# EAGLE design pattern_game (EAGLE 9.6.2)
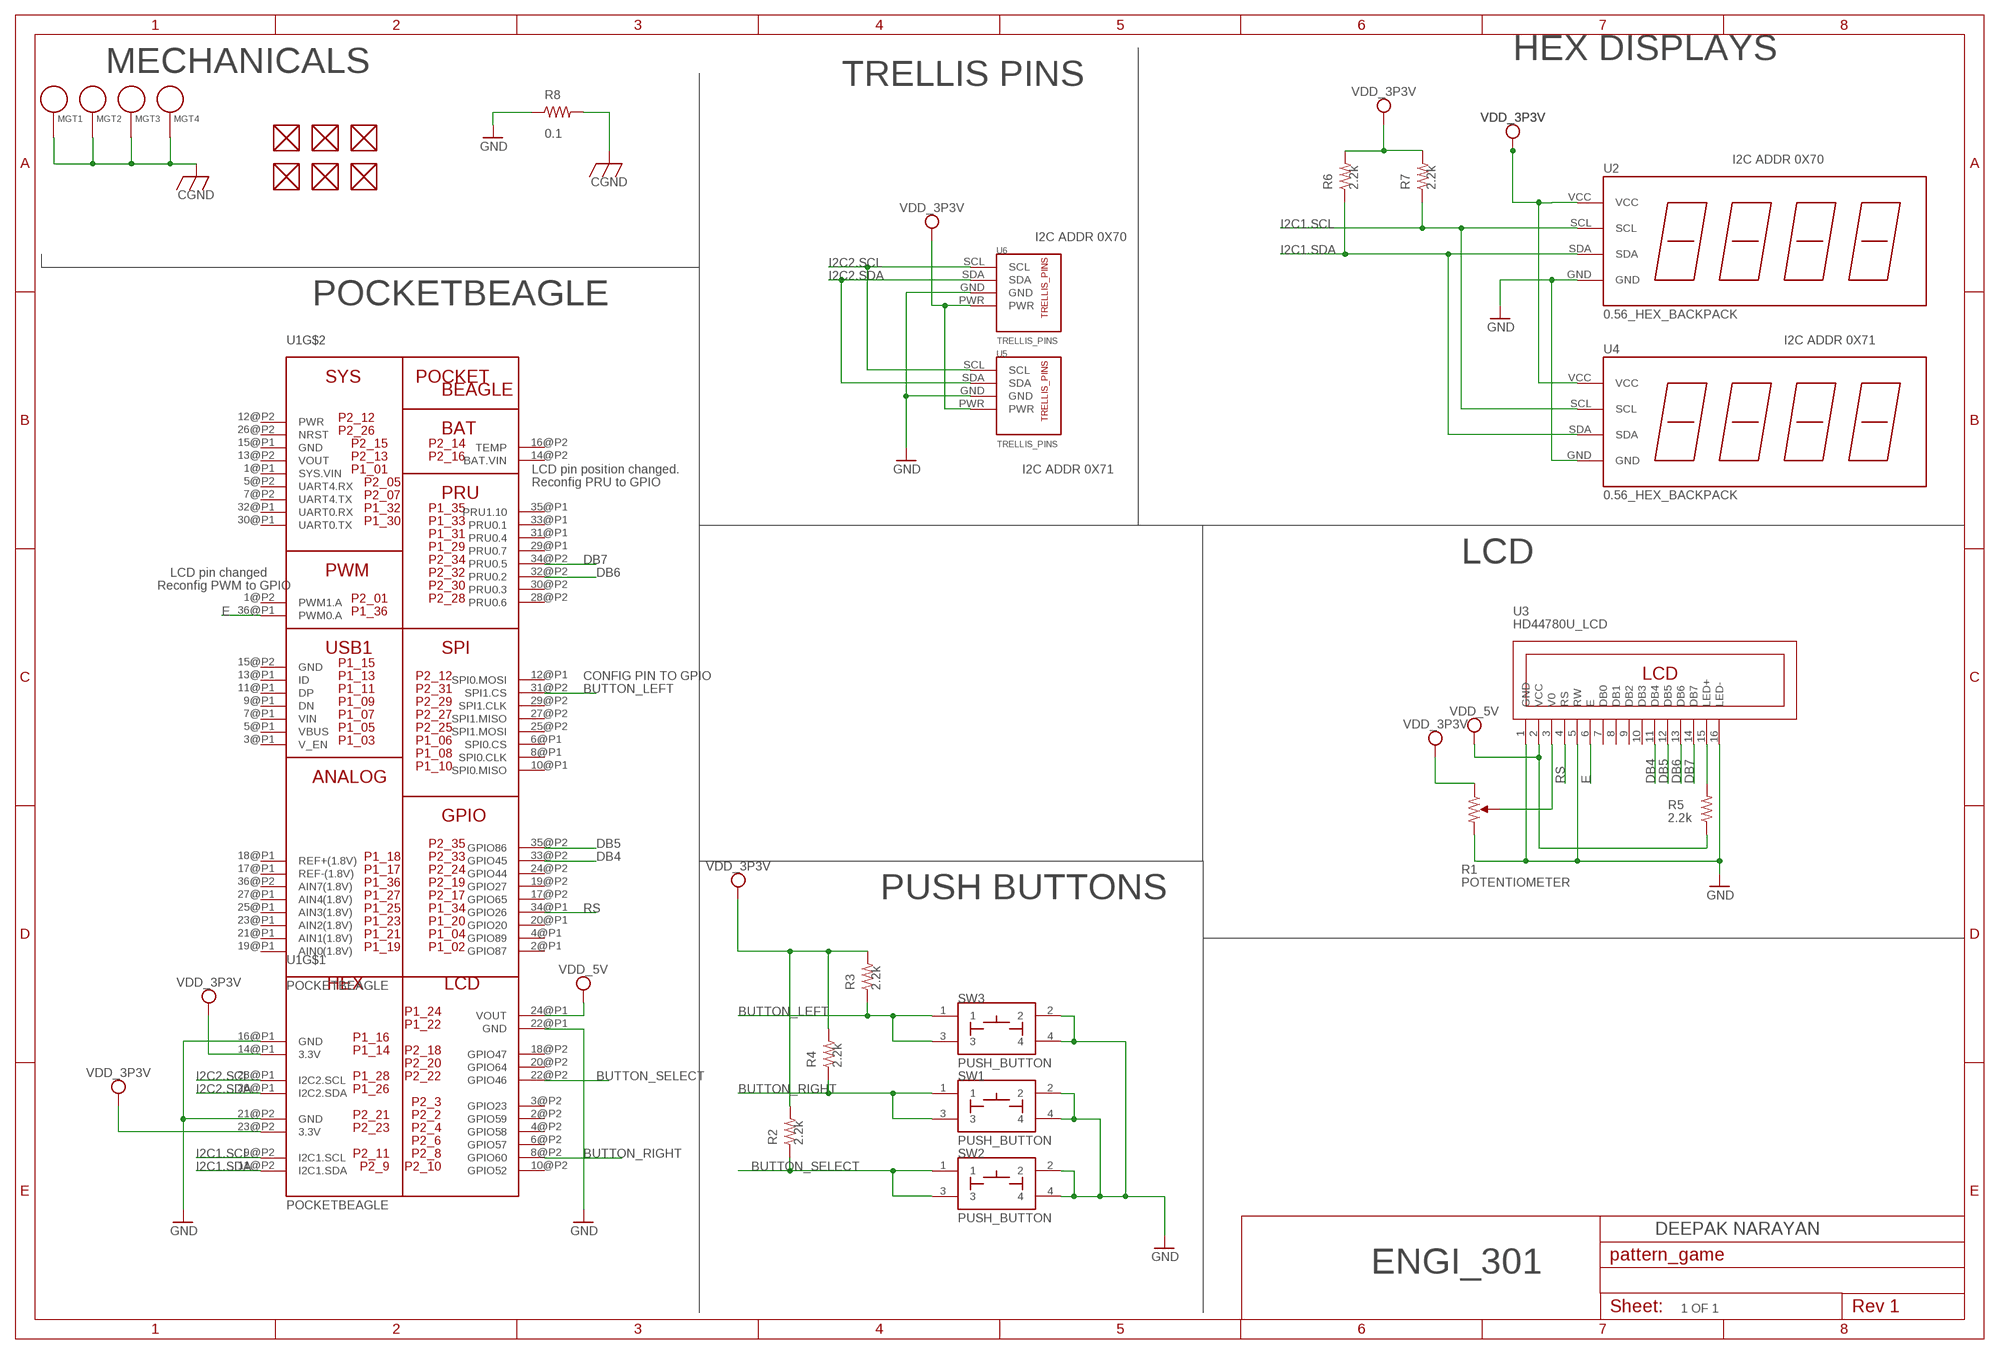
[diagram p0: schematic, sheet 1]

## Parts
FUD1  FIDUCIAL  [FIDUCIAL_40MIL]
FUD2  FIDUCIAL  [FIDUCIAL_40MIL]
FUD3  FIDUCIAL  [FIDUCIAL_40MIL]
FUD4  FIDUCIAL  [FIDUCIAL_40MIL]
FUD5  FIDUCIAL  [FIDUCIAL_40MIL]
FUD6  FIDUCIAL  [FIDUCIAL_40MIL]
MGT1  MOUNTING_HOLE  [MOUNTING_HOLE]
MGT2  MOUNTING_HOLE  [MOUNTING_HOLE]
MGT3  MOUNTING_HOLE  [MOUNTING_HOLE]
MGT4  MOUNTING_HOLE  [MOUNTING_HOLE]
R1  POTENTIOMETER  [POT-PO90S]
R2  2.2k  R_R0603  [R0603]
R3  2.2k  R_R0603  [R0603]
R4  2.2k  R_R0603  [R0603]
R5  2.2k  R_R0603  [R0603]
R6  2.2k  R_R0603  [R0603]
R7  2.2k  R_R0603  [R0603]
R8  0.1  R_R0603  [R0603]
SW1  PUSH_BUTTON  [BUTTON_12.5MM]
SW2  PUSH_BUTTON  [BUTTON_12.5MM]
SW3  PUSH_BUTTON  [BUTTON_12.5MM]
U1  POCKETBEAGLE  [POCKETBEAGLE]
U2  0.56_HEX_BACKPACK  [0.56_HEX_BACKPACK]
U3  HD44780U_LCD  [HD44780U_LCD]
U4  0.56_HEX_BACKPACK  [0.56_HEX_BACKPACK]
U5  TRELLIS_PINS  [TRELLIS_PINS]
U6  TRELLIS_PINS  [TRELLIS_PINS]

## Nets
BUTTON_LEFT: R3.1 SW3.1 SW3.3 U1.31@P2(SPI1.CS)
BUTTON_RIGHT: R4.1 SW1.1 SW1.3 U1.8@P2(GPIO60)
BUTTON_SELECT: R2.1 SW2.1 SW2.3 U1.22@P2(GPIO46)
CGND: MGT1.P$1 MGT2.P$1 MGT3.P$1 MGT4.P$1 R8.2
DB4: U1.33@P2(GPIO45) U3.11(DB4)
DB5: U1.35@P2(GPIO86) U3.12(DB5)
DB6: U1.32@P2(PRU0.2) U3.13(DB6)
DB7: U1.34@P2(PRU0.5) U3.14(DB7)
E: U1.36@P1(PWM0.A) U3.6(E)
GND: R1.CW R8.1 SW1.2 SW1.4 SW2.2 SW2.4 SW3.2 SW3.4 U1.16@P1(GND) U1.21@P2(GND) U1.22@P1(GND) U2.GND U3.1(GND) U3.5(RW) U3.16(LED-) U4.GND U5.GND U6.GND
I2C1.SCL: R7.1 U1.9@P2(I2C1.SCL) U2.SCL U4.SCL
I2C1.SDA: R6.1 U1.11@P2(I2C1.SDA) U2.SDA U4.SDA
I2C2.SCL: U1.28@P1(I2C2.SCL) U5.SCL U6.SCL
I2C2.SDA: U1.26@P1(I2C2.SDA) U5.SDA U6.SDA
N$1: R1.S U3.3(V0)
N$2: R5.2 U3.15(LED+)
RS: U1.34@P1(GPIO26) U3.4(RS)
VDD_3P3V: R1.CCW R2.2 R3.2 R4.2 R6.2 R7.2 U1.14@P1(3.3V) U1.23@P2(3.3V) U2.VCC U4.VCC U5.PWR U6.PWR
VDD_5V: R5.1 U1.24@P1(VOUT) U3.2(VCC)
Unconnected: FUD1.P$1 FUD2.P$1 FUD3.P$1 FUD4.P$1 FUD5.P$1 FUD6.P$1 U1.1@P1(SYS.VIN) U1.1@P2(PWM1.A) U1.2@P1(GPIO87) U1.2@P2(GPIO59) U1.3@P1(V_EN) U1.3@P2(GPIO23) U1.4@P1(GPIO89) U1.4@P2(GPIO58) U1.5@P1(VBUS) U1.5@P2(UART4.RX) U1.6@P1(SPI0.CS) U1.6@P2(GPIO57) U1.7@P1(VIN) U1.7@P2(UART4.TX) U1.8@P1(SPI0.CLK) U1.9@P1(DN) U1.10@P1(SPI0.MISO) U1.10@P2(GPIO52) U1.11@P1(DP) U1.12@P1(SPI0.MOSI) U1.12@P2(PWR) U1.13@P1(ID) U1.13@P2(VOUT) U1.14@P2(BAT.VIN) U1.15@P1(GND) U1.15@P2(GND) U1.16@P2(TEMP) U1.17@P1(REF-(1.8V)) U1.17@P2(GPIO65) U1.18@P1(REF+(1.8V)) U1.18@P2(GPIO47) U1.19@P1(AIN0(1.8V)) U1.19@P2(GPIO27) U1.20@P1(GPIO20) U1.20@P2(GPIO64) U1.21@P1(AIN1(1.8V)) U1.23@P1(AIN2(1.8V)) U1.24@P2(GPIO44) U1.25@P1(AIN3(1.8V)) U1.25@P2(SPI1.MOSI) U1.26@P2(NRST) U1.27@P1(AIN4(1.8V)) U1.27@P2(SPI1.MISO) U1.28@P2(PRU0.6) U1.29@P1(PRU0.7) U1.29@P2(SPI1.CLK) U1.30@P1(UART0.TX) U1.30@P2(PRU0.3) U1.31@P1(PRU0.4) U1.32@P1(UART0.RX) U1.33@P1(PRU0.1) U1.35@P1(PRU1.10) U1.36@P2(AIN7(1.8V)) U3.7(DB0) U3.8(DB1) U3.9(DB2) U3.10(DB3)

## Notes on the sheet
- HEX DISPLAYS
- MECHANICALS
- TRELLIS PINS
- I2C ADDR 0X70
- I2C ADDR 0X70
- POCKETBEAGLE
- I2C ADDR 0X71
- LCD pin position changed. | I2C ADDR 0X71
- Reconfig PRU to GPIO
- LCD
- LCD pin changed
- Reconfig PWM to GPIO
- CONFIG PIN TO GPIO
- PUSH BUTTONS
- DEEPAK NARAYAN
- ENGI_301
- 1 OF 1

## Library data of the parts
FUD1-FUD6 = combo_lock:FIDUCIAL
MGT1-MGT4 = combo_lock:MOUNTING_HOLE: Chassis Mounting Hole w/GND connection ability
R1 = PATTERN_GAME:POTENTIOMETER: Potentiometer - Examples: P090S-14T20BR10K (987-1277-ND)
R2-R7 = PATTERN_GAME:R_: RESISTOR, American symbol
R8 = combo_lock:R_: RESISTOR, American symbol
SW1-SW3 = PATTERN_GAME:PUSH_BUTTON
U1 = PATTERN_GAME:POCKETBEAGLE
U2 U4 = PATTERN_GAME:0.56_HEX_BACKPACK
U3 = PATTERN_GAME:HD44780U_LCD
U5 U6 = PATTERN_GAME:TRELLIS_PINS

## Board
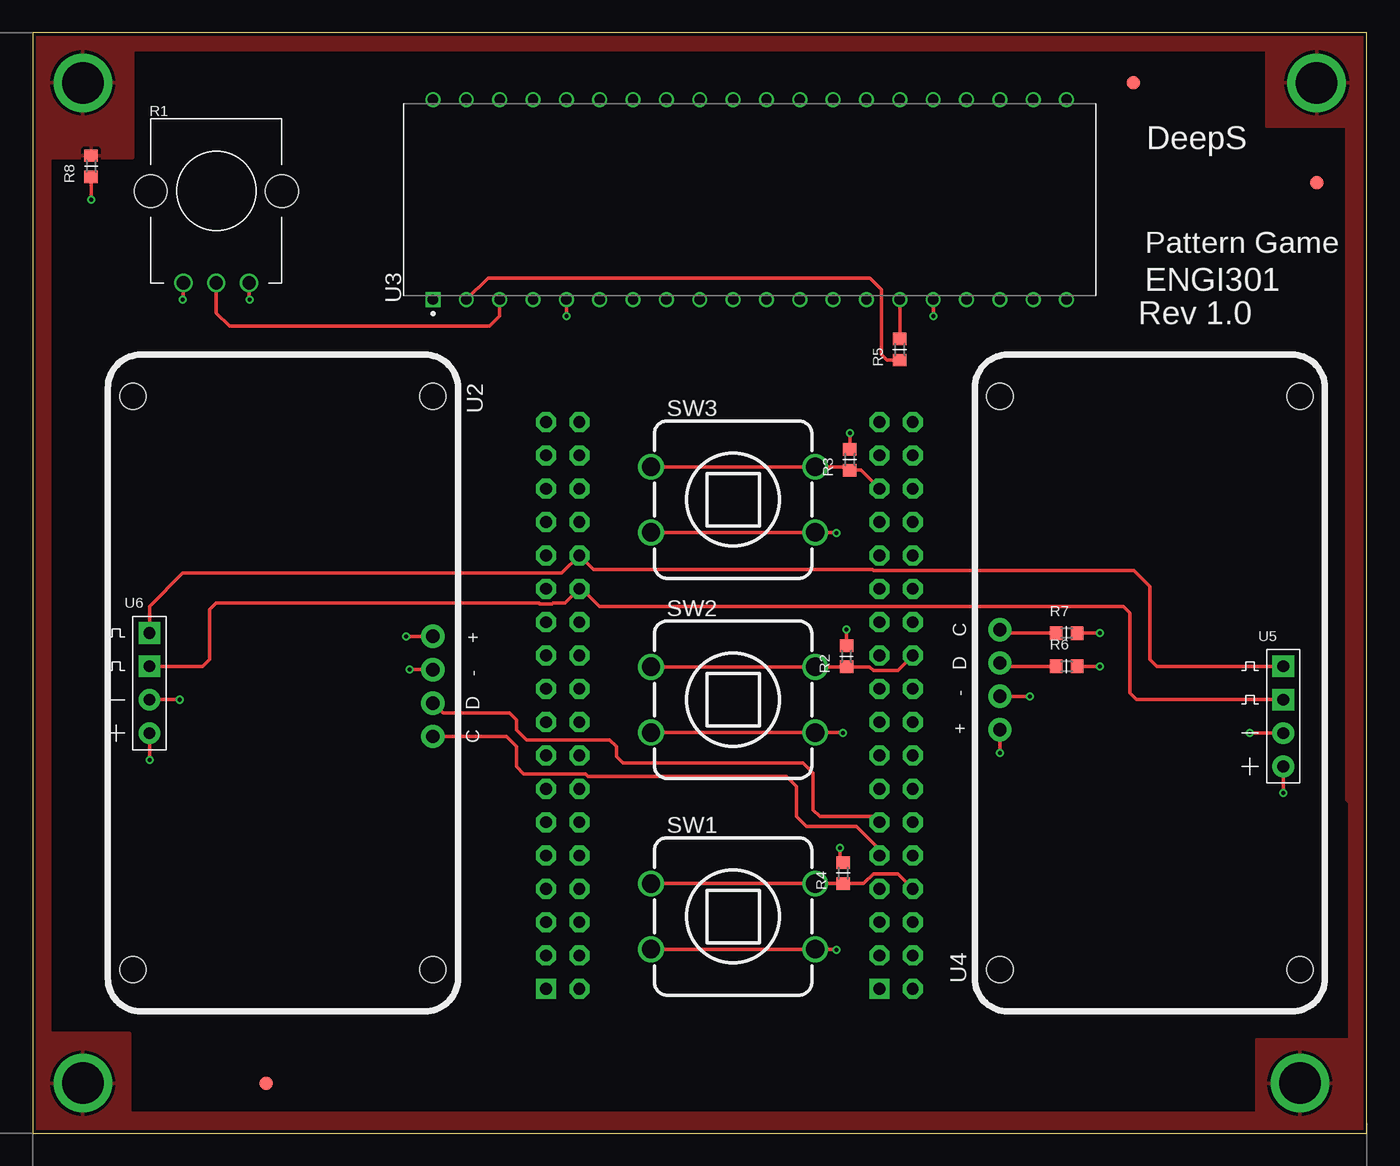
[diagram p1: board, top side]
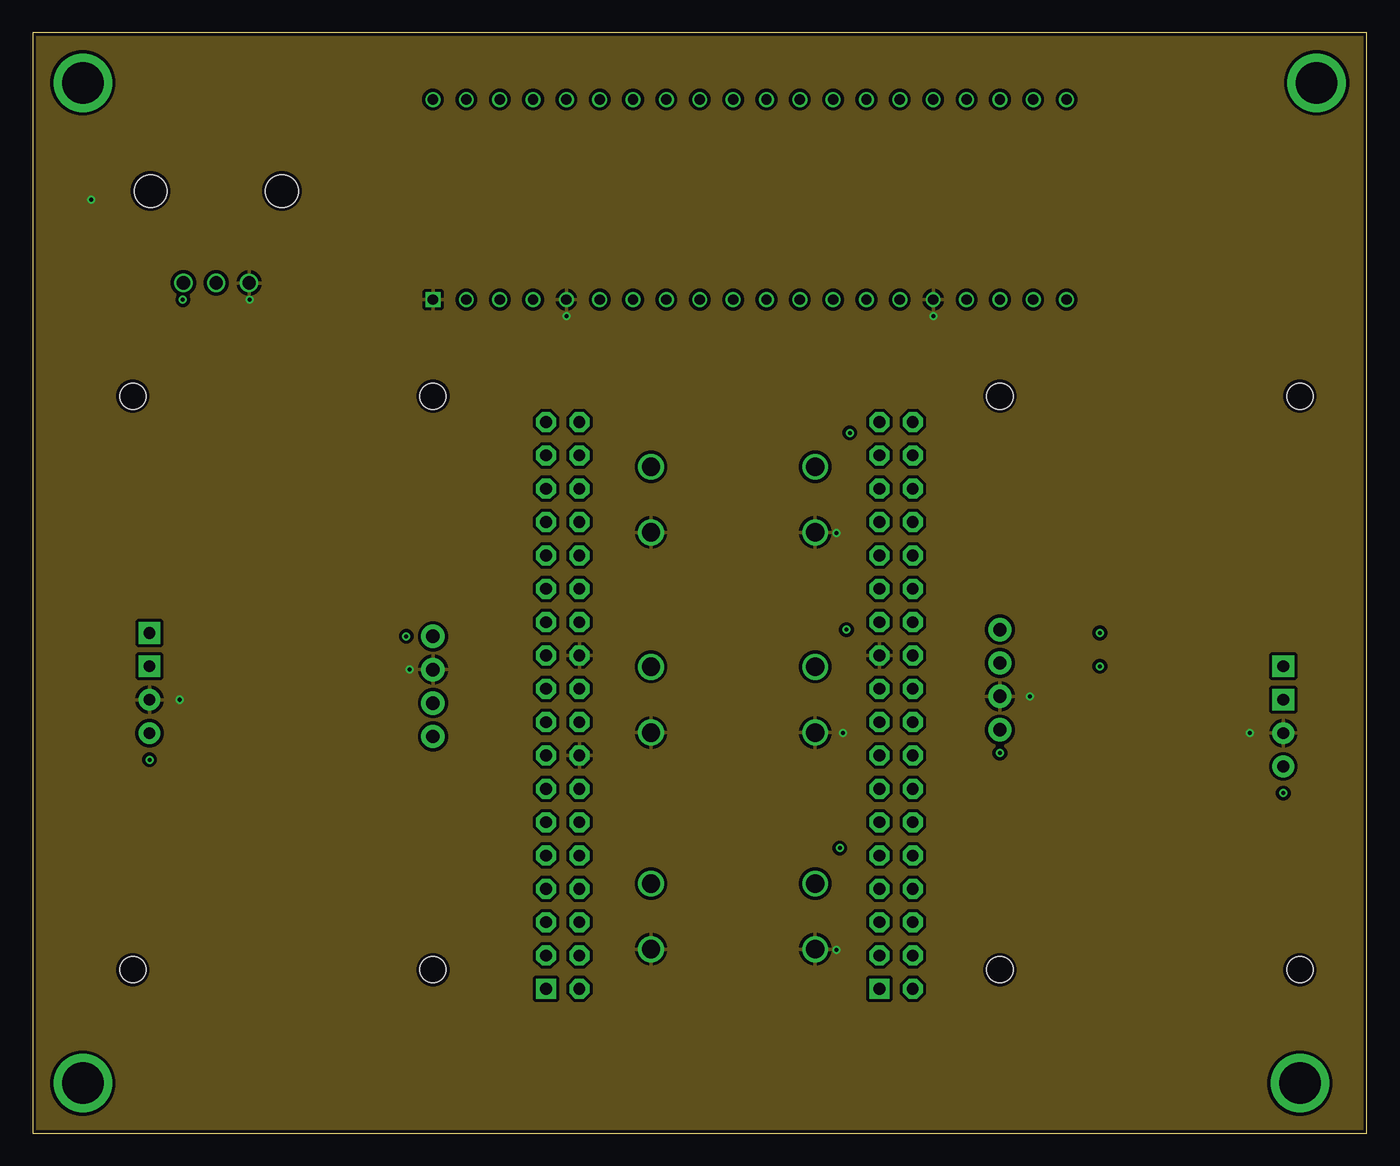
[diagram p2: board, inner layer Route2]
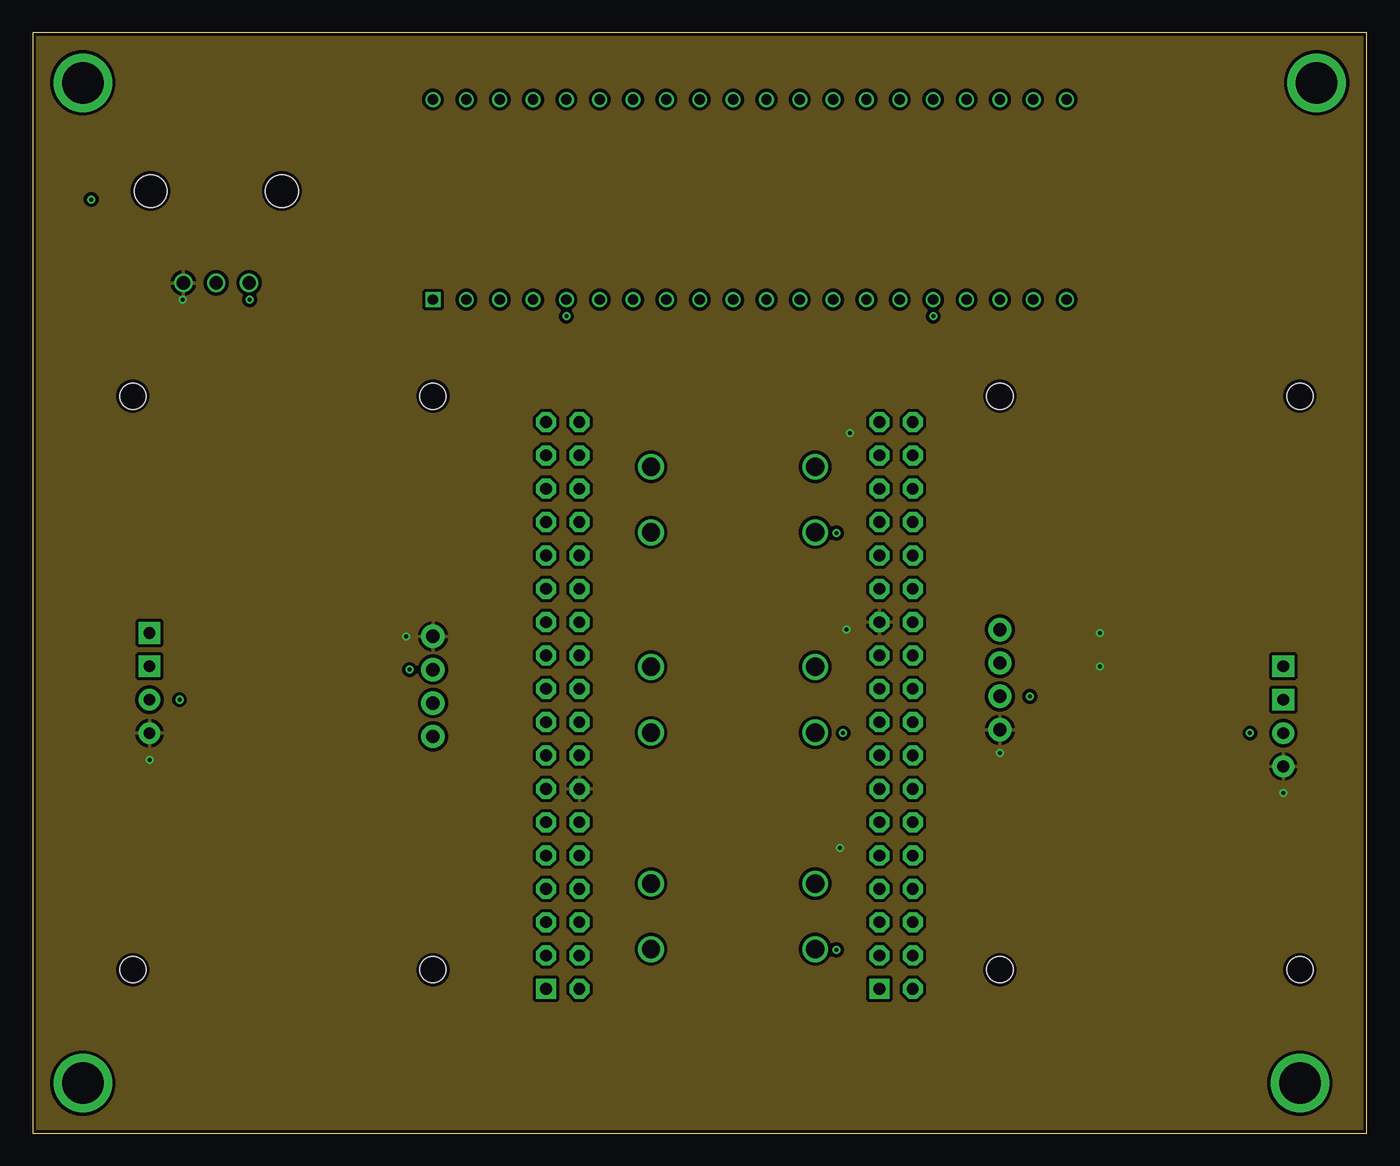
[diagram p3: board, inner layer Route15]
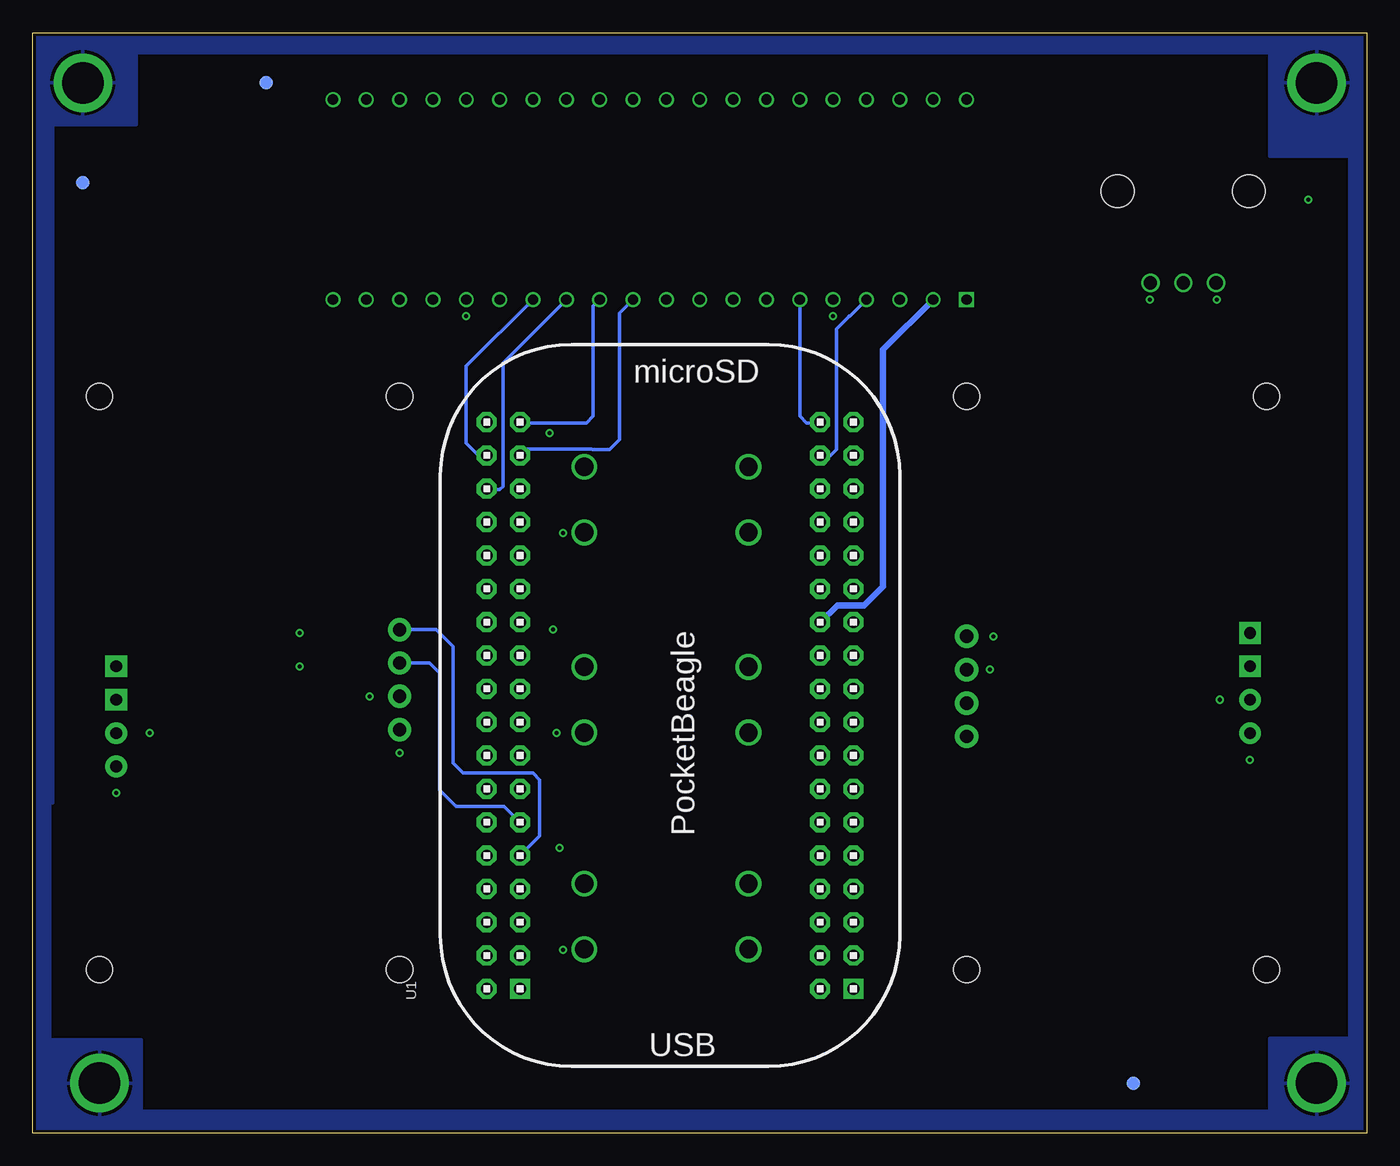
[diagram p4: board, bottom side, seen from below]

Size 101.6 x 83.82 mm. Coordinates in mm from the lower left corner, seen from the top.
Outline: 0,0 101.6,0 101.6,83.82 0,83.82 0,0
Copper layers (1*2*15*16): Top 0.035mm / dielectric 0.23mm / Route2 0.035mm / dielectric 0.93mm / Route15 0.035mm / dielectric 0.23mm / Bottom 0.035mm
Design rules "ENGI301_4lyr": minimum track width 10mil, minimum drill 12mil, track to track 10mil, track to pad 10mil, pad to pad 10mil, via to via 10mil, smd to smd 10mil, copper to edge 10mil, drill to drill 12mil, minimum pad ring 6mil, minimum via ring 6mil, stop-mask expansion 3mil, vias tented up to drill 25mil, thermal gap 10mil

### Footprints (pad centres in the part's own frame; a part is rotated, then mirrored left to right if it is on the bottom)
FIDUCIAL_40MIL = smd 1.016 x 1.016: P$1 0,0
MOUNTING_HOLE = drill 3.175 pad 4.445: P$1 0,0
POT-PO90S = drill 1: CCW -2.5,0; CW 2.5,0; S 0,0 | hole 2.5: -5,7; 5,7
R0603 = smd 0.95 x 1.031: 1 -0.8,0; 2 0.8,0
BUTTON_12.5MM = drill 1.4: 1 -6.25,2.5; 2 -6.25,-2.5; 3 6.25,2.5; 4 6.25,-2.5
POCKETBEAGLE = drill 0.889 pad 1.524 square: 1@P1 5.91,3.53; 1@P2 5.91,28.93 | drill 0.889 pad 1.524 octagon: 2@P1 5.91,6.07; 2@P2 5.91,31.47; 3@P1 8.45,3.53; 3@P2 8.45,28.93; 4@P1 8.45,6.07; 4@P2 8.45,31.47; 5@P1 10.99,3.53; 5@P2 10.99,28.93; 6@P1 10.99,6.07; 6@P2 10.99,31.47; 7@P1 13.53,3.53; 7@P2 13.53,28.93; 8@P1 13.53,6.07; 8@P2 13.53,31.47; 9@P1 16.07,3.53; 9@P2 16.07,28.93; 10@P1 16.07,6.07; 10@P2 16.07,31.47; 11@P1 18.61,3.53; 11@P2 18.61,28.93; 12@P1 18.61,6.07; 12@P2 18.61,31.47; 13@P1 21.15,3.53; 13@P2 21.15,28.93; 14@P1 21.15,6.07; 14@P2 21.15,31.47; 15@P1 23.69,3.53; 15@P2 23.69,28.93; 16@P1 23.69,6.07; 16@P2 23.69,31.47; 17@P1 26.23,3.53; 17@P2 26.23,28.93; 18@P1 26.23,6.07; 18@P2 26.23,31.47; 19@P1 28.77,3.53; 19@P2 28.77,28.93; 20@P1 28.77,6.07; 20@P2 28.77,31.47; 21@P1 31.31,3.53; 21@P2 31.31,28.93; 22@P1 31.31,6.07; 22@P2 31.31,31.47; 23@P1 33.85,3.53; 23@P2 33.85,28.93; 24@P1 33.85,6.07; 24@P2 33.85,31.47; 25@P1 36.39,3.53; 25@P2 36.39,28.93; 26@P1 36.39,6.07; 26@P2 36.39,31.47; 27@P1 38.93,3.53; 27@P2 38.93,28.93; 28@P1 38.93,6.07; 28@P2 38.93,31.47; 29@P1 41.47,3.53; 29@P2 41.47,28.93; 30@P1 41.47,6.07; 30@P2 41.47,31.47; 31@P1 44.01,3.53; 31@P2 44.01,28.93; 32@P1 44.01,6.07; 32@P2 44.01,31.47; 33@P1 46.55,3.53; 33@P2 46.55,28.93; 34@P1 46.55,6.07; 34@P2 46.55,31.47; 35@P1 49.09,3.53; 35@P2 49.09,28.93; 36@P1 49.09,6.07; 36@P2 49.09,31.47
0.56_HEX_BACKPACK = drill 1.016 pad 1.778: GND -1.016,11.43; SCL 4.064,11.43; SDA 1.524,11.43; VCC -3.556,11.43 | hole 2: -21.844,-11.43; 21.844,-11.43; -21.844,11.43; 21.844,11.43
HD44780U_LCD = drill 0.79 pad 1.14 square: 1 -7.62,24.13 | drill 0.79 pad 1.14: 2 -7.62,21.59; 3 -7.62,19.05; 4 -7.62,16.51; 5 -7.62,13.97; 6 -7.62,11.43; 7 -7.62,8.89; 8 -7.62,6.35; 9 -7.62,3.81; 10 -7.62,1.27; 11 -7.62,-1.27; 12 -7.62,-3.81; 13 -7.62,-6.35; 14 -7.62,-8.89; 15 -7.62,-11.43; 16 -7.62,-13.97; 17 -7.62,-16.51; 18 -7.62,-19.05; 19 -7.62,-21.59; 20 -7.62,-24.13; 21 7.62,-24.13; 22 7.62,-21.59; 23 7.62,-19.05; 24 7.62,-16.51; 25 7.62,-13.97; 26 7.62,-11.43; 27 7.62,-8.89; 28 7.62,-6.35; 29 7.62,-3.81; 30 7.62,-1.27; 31 7.62,1.27; 32 7.62,3.81; 33 7.62,6.35; 34 7.62,8.89; 35 7.62,11.43; 36 7.62,13.97; 37 7.62,16.51; 38 7.62,19.05; 39 7.62,21.59; 40 7.62,24.13
TRELLIS_PINS = drill 0.889 pad 1.651: GND 0,-1.27; PWR 0,-3.81 | drill 0.889 pad 1.651 square: SCL 0,3.81; SDA 0,1.27

### Placement (x,y rotation side)
FUD1  97.79,72.39 0 top
FUD2  83.82,80.01 0 top
FUD3  17.78,3.81 0 top
FUD4  83.82,80.01 0 bottom
FUD5  97.79,72.39 0 bottom
FUD6  17.78,3.81 270 bottom
MGT1  3.81,80.01 0 top
MGT2  3.81,3.81 0 top
MGT3  97.79,80.01 0 top
MGT4  96.52,3.81 0 top
R1  13.97,64.77 0 top
R2  61.98,36.32 90 top
R3  62.23,51.31 90 top
R4  61.72,19.81 90 top
R5  66.04,59.69 90 top
R6  78.74,35.56 0 top
R7  78.74,38.1 0 top
R8  4.45,73.66 90 top
SW1  53.34,16.51 0 top
SW2  53.34,33.02 0 top
SW3  53.34,48.26 0 top
U1  35.56,5.08 90 bottom
U2  19.05,34.29 270 top
U3  54.61,71.12 90 top
U4  85.09,34.29 90 top
U5  95.25,31.75 0 top
U6  8.89,34.29 0 top

### Tracks (layer width: path | path; a pad name or v marks a point on that pad's centre or on a via)
BUTTON_LEFT
  Top 0.254: SW3.1 59.44,50.76 SW3.3 61.98,50.76 R3.1 63.07,50.51 U1.31@P2
BUTTON_RIGHT
  Top 0.254: SW1.1 SW1.3 61.21,19.01 | U1.8@P2 65.89,19.75 64.02,19.75 63.27,19.01 61.22,19.01 61.21,19.01 | 61.21,19.01 R4.1
BUTTON_SELECT
  Top 0.254: SW2.1 SW2.3 R2.1 | U1.22@P2 65.89,35.25 64.02,35.25 63.74,35.52 R2.1 | R2.1
CGND
  pour Top: 1.27,25.4 1.27,74.3 7.62,74.3 7.62,82.55 93.98,82.55 93.98,76.71 100.08,76.71 100.08,25.4 100.33,25.15 102.87,25.15 102.87,85.09 -0.76,85.09 -1.27,84.58 -1.27,25.4
  pour Top: 1.27,25.4 1.27,7.62 7.37,7.62 7.37,1.52 93.22,1.52 93.22,7.11 100.33,7.11 100.33,25.4 102.87,25.4 102.87,-1.27 -1.27,-1.27 -1.27,25.4
  pour Bottom: 100.08,25.15 100.08,76.83 93.73,76.83 93.73,82.3 7.37,82.3 7.37,74.42 1.27,74.42 1.27,25.15 1.02,24.89 -1.52,24.89 -1.52,84.84 102.11,84.84 102.62,84.33 102.62,25.15
  pour Bottom: 100.33,25.53 100.33,7.11 93.34,7.11 93.34,1.65 7.37,1.65 7.37,7.24 1.27,7.24 1.27,25.53 -1.27,25.53 -1.27,-1.14 102.87,-1.14 102.87,25.53
DB4
  Bottom 0.254: U3.11 56.9,62.48 56.9,52.83 57.66,52.07 58.98,52.07 59.03,52.12 64,52.12 U1.33@P2
DB5
  Bottom 0.254: U3.12 58.93,62.99 58.93,54.61 59.44,54.1 64.42,54.1 U1.35@P2
DB6
  Bottom 0.254: U1.32@P2 66.96,49.02 66.04,49.02 65.79,49.28 65.79,58.67 U3.13
DB7
  Bottom 0.254: U3.14 68.58,58.42 68.58,52.58 67.63,51.63 U1.34@P2
E
  Bottom 0.254: U3.6 43.18,54.61 42.67,54.1 41.7,54.1 U1.36@P1
GND  (via drill 0.3 pad 0.61)
  Top 0.254: U2.GND v28.7,35.31 | U6.GND v11.18,33.02 | v61.72,30.48 61.68,30.52 SW2.4 SW2.2 | v61.21,13.97 61.17,14.01 SW1.4 SW1.2 | v61.21,45.72 61.17,45.76 SW3.4 SW3.2 | U5.GND v92.71,30.48 | U4.GND v75.95,33.27 | U3.5 v40.64,62.23 | R1.CW 16.47,63.54 v16.51,63.5 | U3.16 v68.58,62.23 | R8.1 v4.45,71.12
  pour Route2: -2.54,-2.54 -2.54,86.36 104.14,86.36 104.14,-2.54
I2C1.SCL
  Top 0.254: R7.1 73.91,38.1 U4.SCL | U2.SCL 36.07,30.23 36.83,29.46 36.83,27.94 37.4,27.37 42.1,27.37 42.3,27.18 57.4,27.18 58.17,26.42 58.17,24.13 58.93,23.37 62.74,23.37 64.49,21.62 U1.9@P2
  Bottom 0.254: U1.9@P2 62.99,22.65 62.99,26.92 63.5,27.43 68.83,27.43 69.6,28.19 69.6,37.08 70.87,38.35 U4.SCL
I2C1.SDA
  Top 0.254: R6.1 73.66,35.56 U4.SDA | U2.SDA 31.24,32 36.32,32 36.83,31.5 36.83,30.73 37.59,29.97 43.94,29.97 44.45,29.46 44.45,28.7 44.96,28.19 58.67,28.19 59.44,27.43 59.44,24.64 59.94,24.13 64.05,24.13 U1.11@P2
  Bottom 0.254: U1.11@P2 65.69,24.89 69.34,24.89 70.61,26.16 70.61,35.05 71.12,35.56 71.37,35.81 U4.SDA
I2C2.SCL
  Top 0.254: U6.SCL 8.89,40.13 11.43,42.67 40.29,42.67 U1.28@P1 42.71,42.93 63.96,42.93 64.02,42.87 83.88,42.87 85.09,41.66 85.09,36.07 85.6,35.56 U5.SCL
I2C2.SDA
  Top 0.254: U6.SDA 12.95,35.56 13.46,36.07 13.46,39.88 13.97,40.39 38.56,40.39 38.62,40.33 39.56,40.33 39.62,40.39 40.55,40.39 U1.26@P1 41.84,41.47 43.18,40.13 83.06,40.13 83.57,39.62 83.57,33.53 84.07,33.02 U5.SDA
N$1
  Top 0.254: R1.S 13.97,62.48 14.99,61.47 34.8,61.47 35.56,62.23 U3.3
N$2
  Top 0.254: U3.15 R5.2
RS
  Bottom 0.254: U3.4 39.37,62.23 39.45,62.23 39.45,62.2 40.39,61.26 40.39,52.07 40.83,51.63 U1.34@P1
VDD_3P3V  (via drill 0.3 pad 0.61)
  Top 0.254: R6.2 v81.28,35.56 | R7.2 v81.28,38.1 | R3.2 v62.23,53.34 | R2.2 v61.98,38.35 | R4.2 61.47,20.87 v61.47,21.72 | U4.VCC v73.66,28.96 | U2.VCC v28.45,37.85 | U6.PWR v8.89,28.45 | U5.PWR v95.25,25.91 | R1.CCW 11.47,63.54 v11.43,63.5
  pour Route15: -5.08,-5.08 -5.08,88.9 106.68,88.9 106.68,-5.08
VDD_5V
  Top 0.254: U3.2 34.67,65.15 63.75,65.15 64.64,64.26 64.64,59.31 65.06,58.89 R5.1
  Bottom 0.508: U3.2 36.83,59.69 36.83,41.66 38.29,40.2 40.33,40.2 41.59,38.93 U1.24@P1

### Text on the board
tPlace: DeepS | Pattern Game | ENGI301 | Rev 1.0